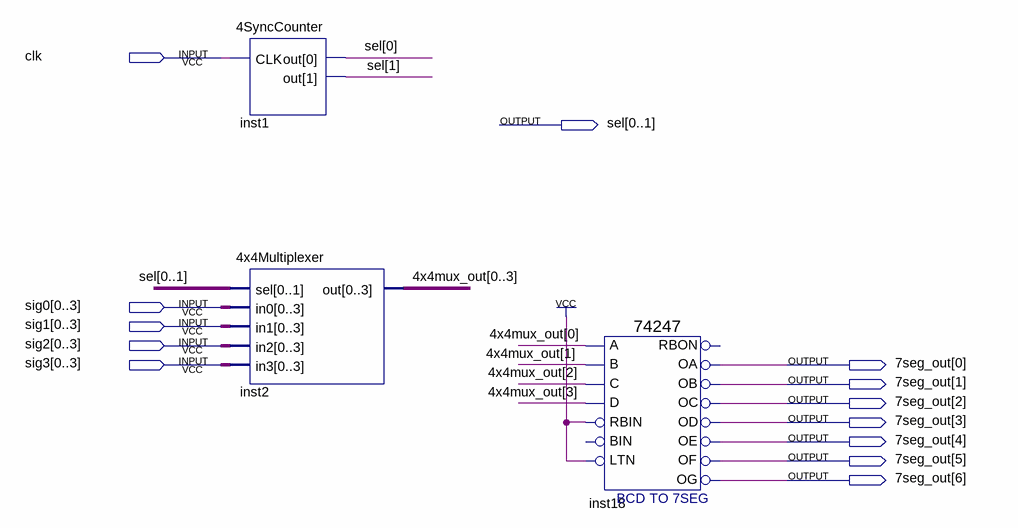
[diagram p0: schematic sheet]
// Quartus schematic 7SegmentController.bdf as structural Verilog: 3 symbols, 13 pins
module \7SegmentController  (
  input  clk,
  input  [0:3] sig0,
  input  [0:3] sig1,
  input  [0:3] sig2,
  input  [0:3] sig3,
  output [0:1] sel,
  output [6:0] \7seg_out 
);

  wire [3:0] \4x4mux_out ;

  \4SyncCounter  inst1 (.CLK(clk), .out({sel[1], sel[0]}));
  \4x4Multiplexer  inst2 (
    .sel(sel), .in0(sig0), .in1(sig1), .in2(sig2), .in3(sig3),
    .out({\4x4mux_out [0], \4x4mux_out [1], \4x4mux_out [2], \4x4mux_out [3]}));
  \74247  inst18 (
    .LTN(1'b1), .A(\4x4mux_out [0]), .B(\4x4mux_out [1]), .RBIN(1'b1), .C(\4x4mux_out [2]),
    .D(\4x4mux_out [3]), .OF(\7seg_out [5]), .OC(\7seg_out [2]), .OD(\7seg_out [3]), .OE(\7seg_out [4]),
    .OA(\7seg_out [0]), .OB(\7seg_out [1]), .OG(\7seg_out [6]));  // open: BIN, RBON
endmodule
